# EAGLE design fonte1 (EAGLE 9.6.2)
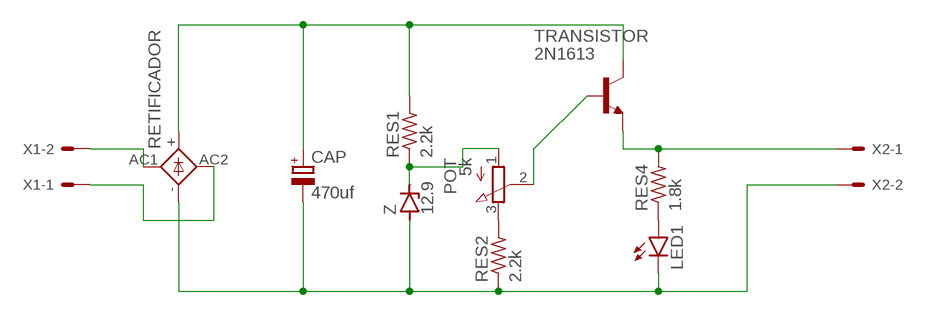
[diagram p0: schematic, sheet 1]

## Parts
CAP  470uf  CPOL-EUE3.5-8  [E3,5-8]
LED1  LED3MM  [LED3MM]
POT  5k  3RP/1610N  [3RP/1610N]
RES1  2.2k  R-US_0207/7  [0207/7]
RES2  2.2k  R-US_0207/7  [0207/7]
RES4  1.8k  R-US_0207/7  [0207/7]
RETIFICADOR  1KAB  [1KAB]
TRANSISTOR  2N1613  [TO5]
X1  KK-156-2  [KK-156-2]
X2  KK-156-2  [KK-156-2]
Z  12.9  ZENER-DIODEC1702-15  [C1702-15]

## Nets
N$1: POT.3(E) RES2.2
N$2: LED1.A RES4.1
N$3: RETIFICADOR.AC1 X1.2
N$4: RETIFICADOR.AC2 X1.1
N$5: CAP.+ RES1.2 RETIFICADOR.+ TRANSISTOR.3(C)
N$6: CAP.- LED1.K(C) RES2.1 RETIFICADOR.- X2.2 Z.A
N$7: POT.1(A) RES1.1 Z.C
N$8: POT.2(S) TRANSISTOR.2(B)
N$9: RES4.2 TRANSISTOR.1(E) X2.1

## Library data of the parts
CAP = rcl:CPOL-EU: POLARIZED CAPACITOR, European symbol; SPICEPREFIX: C
LED1 = led:LED: LED OSRAM: - CHIPLED LG R971, LG N971, LY N971, LG Q971, LY Q971, LO R971, LY R971 LH N974, LH R974 LS Q976, LO Q976, LY Q976 LO Q996 - Hyper CHIPLED LW Q18S LB Q993, LB Q99A, LB R99A - SideLED LS A670, LO A670, LY A670, LG A670, LP A670 LB A673, LV A673, LT A673, LW A673 LH A674 LY A675 LS A676, LA A676, LO A676, LY A676, LW A676 LS A679, LY A679, LG A679 - Hyper Micro SIDELED® LS Y876, LA Y876, LO Y876, LY Y876 LT Y87S - SmartLED LW L88C, LW L88S LB L89C, LB L89S, LG L890 LS L89K, LO L89K, LY L89K LS L896, LA L896, LO L896, LY L896 - TOPLED LS T670, LO T670, LY T670, LG T670, LP T670 LSG T670, LSP T670, LSY T670, LOP T670, LYG T670 LG T671, LOG T671, LSG T671 LB T673, LV T673, LT T673, LW T673 LH T674 LS T676, LA T676, LO T676, LY T676, LB T676, LH T676, LSB T676, LW T676 LB T67C, LV T67C, LT T67C, LS T67K, LO T67K, LY T67K, LW E67C LS E67B, LA E67B, LO E67B, LY E67B, LB E67C, LV E67C, LT E67C LW T67C LS T679, LY T679, LG T679 LS T770, LO T770, LY T770, LG T770, LP T770 LB T773, LV T773, LT T773, LW T773 LH T774 LS E675, LA E675, LY E675, LS T675 LS T776, LA T776, LO T776, LY T776, LB T776 LHGB T686 LT T68C, LB T68C - Hyper Mini TOPLED® LB M676 - Mini TOPLED Santana® LG M470 LS M47K, LO M47K, LY M47K Source: http://www.osram.convergy.de LUXEON: - LUMILED® LXK2-PW12-R00, LXK2-PW12-S00, LXK2-PW14-U00, LXK2-PW14-V00 LXK2-PM12-R00, LXK2-PM12-S00, LXK2-PM14-U00 LXK2-PE12-Q00, LXK2-PE12-R00, LXK2-PE12-S00, LXK2-PE14-T00, LXK2-PE14-U00 LXK2-PB12-K00, LXK2-PB12-L00, LXK2-PB12-M00, LXK2-PB14-N00, LXK2-PB14-P00, LXK2-PB14-Q00 LXK2-PR12-L00, LXK2-PR12-M00, LXK2-PR14-Q00, LXK2-PR14-R00 LXK2-PD12-Q00, LXK2-PD12-R00, LXK2-PD12-S00 LXK2-PH12-R00, LXK2-PH12-S00 LXK2-PL12-P00, LXK2-PL12-Q00, LXK2-PL12-R00 Source: www.luxeon.com KINGBRIGHT: KA-3528ASYC Source: www.kingbright.com
POT = pot:3RP/1610N: 16mm Potentiometer one level Source: http://www.alphapotentiometers.net/html/16mm_pot_2.html
RES1 RES2 RES4 = rcl:R-US_: RESISTOR, American symbol; SPICEPREFIX: R
RETIFICADOR = rectifier:1KAB: RECTIFIER grid 5,08 x 5,08 mm
TRANSISTOR = transistor:2N1613: NPN TRANSISTOR
X1 X2 = con-molex:KK-156-2: KK 156 HEADER Source: http://www.molex.com/pdm_docs/sd/026604100_sd.pdf; MF: MOLEX; OC_FARNELL: unknown; OC_NEWARK: unknown
Z = diode:ZENER-DIODE: Z-Diode

## Board
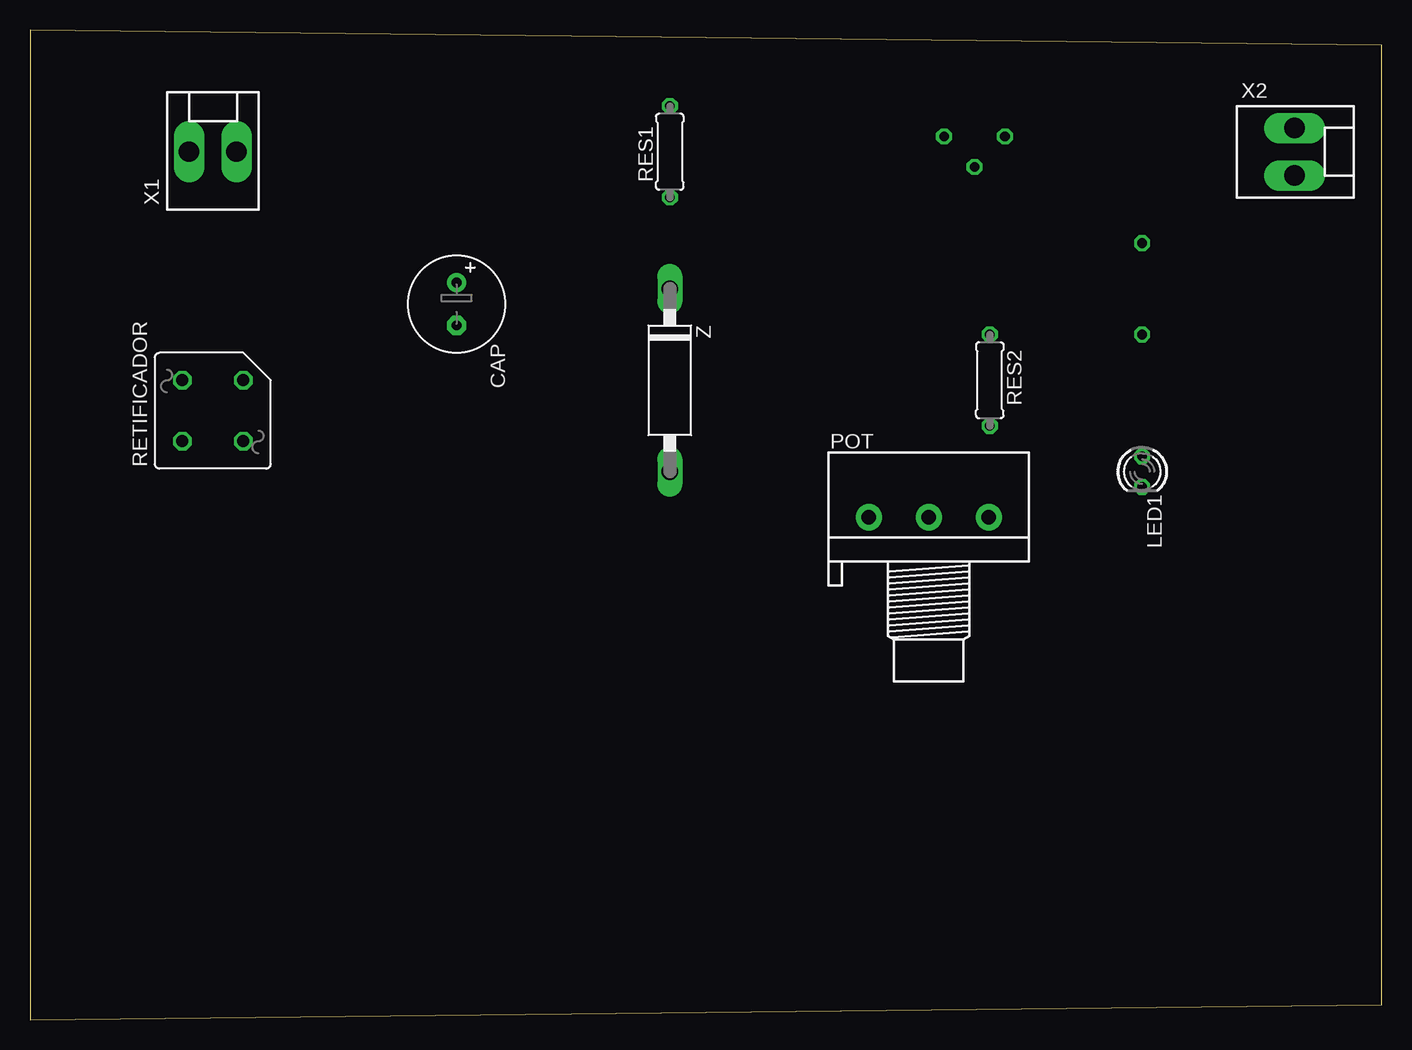
[diagram p1: board, top side]
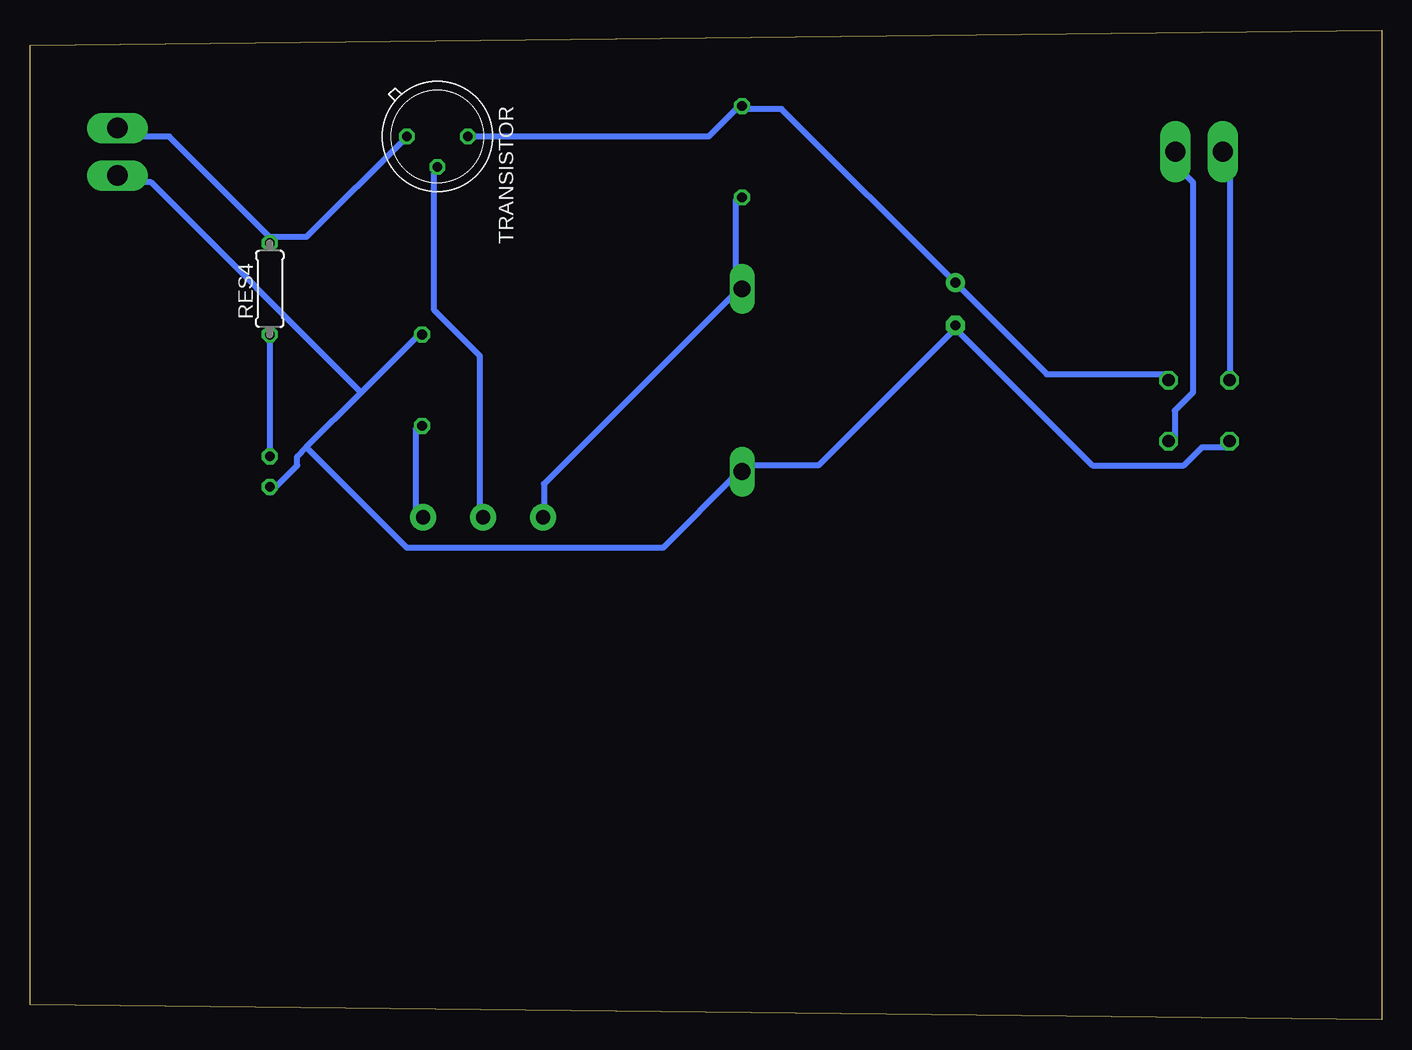
[diagram p2: board, bottom side, seen from below]

Size 112.7 x 82.54 mm. Coordinates in mm from the lower left corner, seen from the top.
Outline: 0,0 112.7,1.27 112.7,81.27 0,82.54 0,0
Copper layers (1*16): Top 0.035mm / dielectric 1.5mm / Bottom 0.035mm
Design rules "default *": minimum track width 20mil, minimum drill 0.35mm, track to track 40mil, track to pad 40mil, pad to pad 40mil, via to via 40mil, smd to smd 6mil, copper to edge 40mil, drill to drill 6mil, minimum pad ring 10mil, minimum via ring 8mil, stop-mask expansion 4mil, vias tented up to drill 0mil, thermal gap 10mil

### Footprints (pad centres in the part's own frame; a part is rotated, then mirrored left to right if it is on the bottom)
E3,5-8 = drill 0.813 pad 1.6: + -1.778,0 | drill 0.813 pad 1.6 octagon: - 1.778,0
LED3MM = drill 0.813 octagon: A -1.27,0; K 1.27,0
3RP/1610N = drill 1.2 pad 2.184: 1 -5,0; 2 0,0; 3 5,0
0207/7 = drill 0.813 octagon: 1 -3.81,0; 2 3.81,0
1KAB = drill 1.016 octagon: + 2.54,-2.54; - -2.54,2.54; AC1 -2.54,-2.54; AC2 2.54,2.54
TO5 = drill 0.813 octagon: 1 0,-2.54; 2 2.54,0; 3 0,2.54
KK-156-2 = drill 1.7 pad 2.184 long: 1 -1.98,0; 2 1.98,0
C1702-15 = drill 1.397 long: A 7.62,0; C -7.62,0

### Placement (x,y rotation side)
CAP  35.56,59.69 270 top
LED1  92.71,45.72 270 top
POT  74.93,41.91 0 top
RES1  53.34,72.39 90 top
RES2  80.01,53.34 270 top
RES4  92.71,60.96 90 bottom
RETIFICADOR  15.24,50.8 90 top
TRANSISTOR  78.74,73.66 270 bottom
X1  15.24,72.39 0 top
X2  105.41,72.39 270 top
Z  53.34,53.34 270 top

### Tracks (layer width: path | path; a pad name or v marks a point on that pad's centre or on a via)
N$1
  Bottom 0.508: RES2.2 80.52,49.28 80.52,42.42 POT.3
N$2
  Bottom 0.508: RES4.1 LED1.A
N$3
  Bottom 0.508: RETIFICADOR.AC1 17.27,48.51 17.27,50.8 15.75,52.32 15.75,69.85 16.51,70.61 16.51,72.14 X1.2
N$4
  Bottom 0.508: RETIFICADOR.AC2 12.7,72.14 X1.1
N$5
  Bottom 0.508: TRANSISTOR.3 56.13,73.66 53.85,75.95 RES1.2 53.09,75.95 50.04,75.95 CAP.+ 27.94,53.85 18.03,53.85 RETIFICADOR.+
N$6
  Bottom 0.508: 89.66,47.75 90.42,46.99 90.42,46.23 92.71,43.94 LED1.K | 89.66,47.75 85.09,52.32 | 85.09,52.32 80.52,56.9 RES2.1 | 85.09,52.32 102.62,69.85 104.9,69.85 X2.2 | 35.56,57.66 24.13,46.23 16.51,46.23 14.99,47.75 12.7,47.75 RETIFICADOR.- | 35.56,57.66 46.99,46.23 53.09,46.23 Z.A 53.85,45.47 59.94,39.37 81.28,39.37 89.66,47.75 | 35.56,57.66 CAP.-
N$7
  Bottom 0.508: RES1.1 53.85,68.33 53.85,61.47 Z.C 53.85,60.71 69.85,44.7 69.85,42.42 POT.1
N$8
  Bottom 0.508: TRANSISTOR.2 78.99,70.61 78.99,59.18 75.18,55.37 75.18,42.42 POT.2
N$9
  Bottom 0.508: 92.71,65.28 89.66,65.28 TRANSISTOR.1 | 92.71,65.28 101.09,73.66 104.9,73.66 X2.1 | 92.71,65.28 RES4.2